# Altium schematic sheet Tiny817_Xplained_Pro_EDBG.SchDoc: Embedded Debugger (EDBG)
size A3; Organization: ATMEL Norway; Address1: Vestre Rosten 79; Address2: N-7075 TILLER; Address3: NORWAY; DocumentNumber: A09-2654; Revision: 4; SheetNumber: 9; SheetTotal: 9; PageSetup: Record=PageOptions|CenterHorizontal=True|CenterVertical=True|PrintScale=0.73|XCorrection=1.00|YCorrection=1.00|PrintKind=1|BorderSize=5000000|LeftOffset=0|BottomOffset=0|Orientation=2|PaperLength=1000|PaperWidth=1000|Scale=100|PaperSource=7|PrintQuality=-4|MediaType=1|DitherType=10|PaperKind=A3 (297 x 420 mm)|PrintScaleMode=1
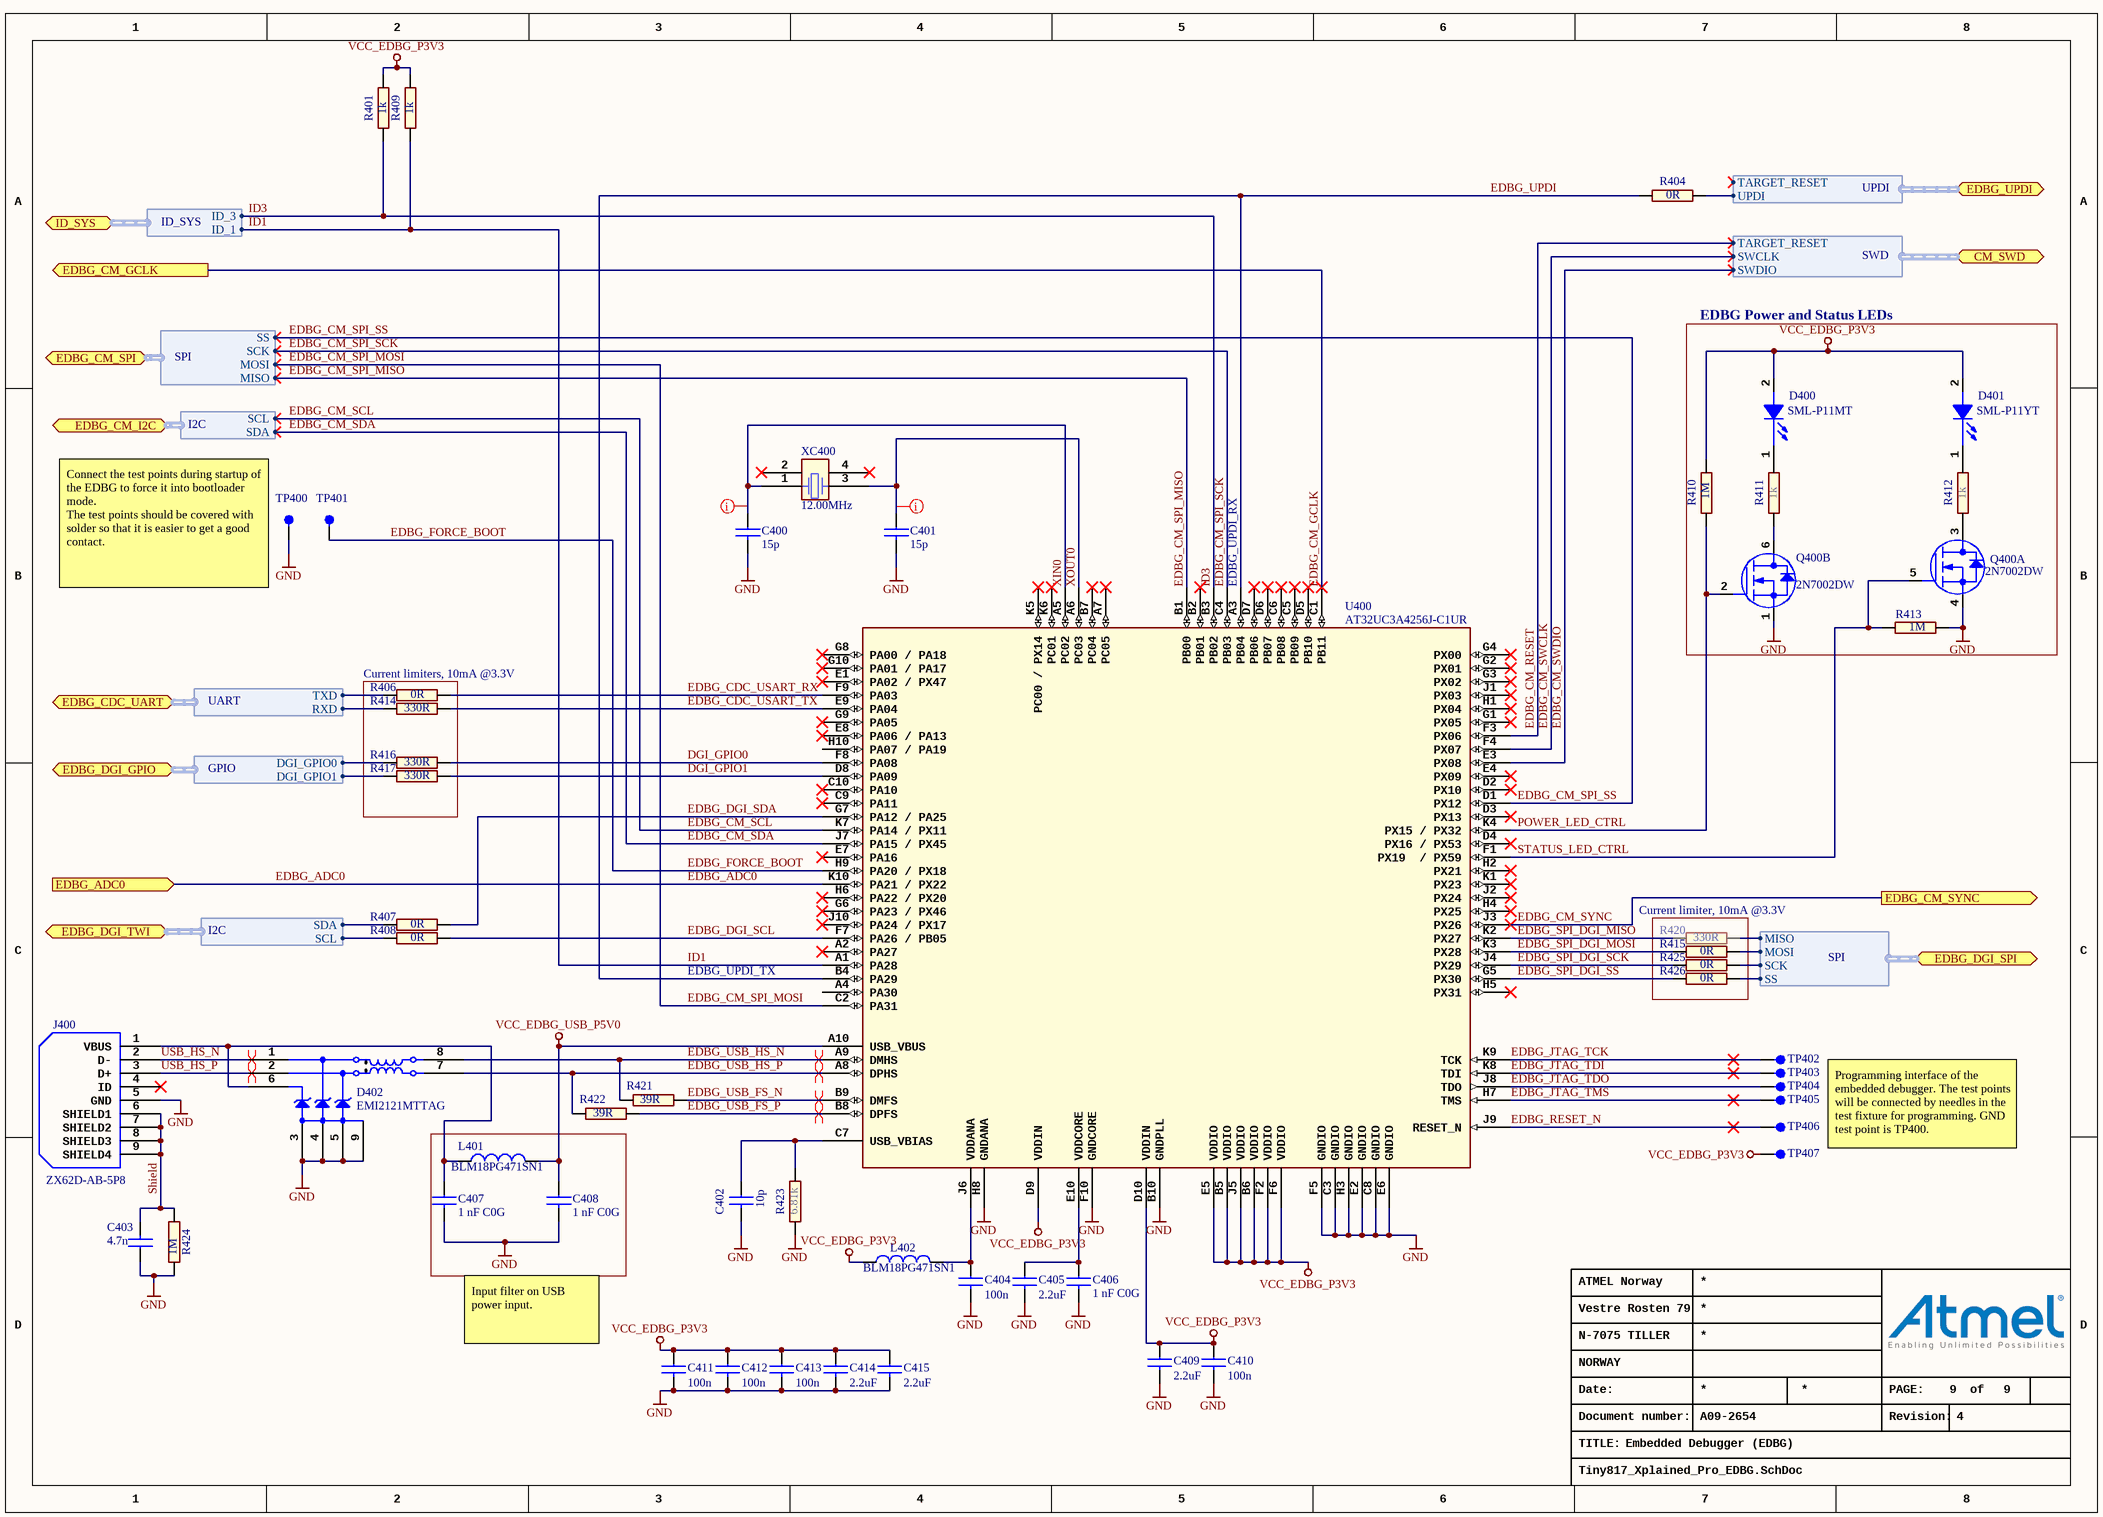
[diagram p0: Tiny817_Xplained_Pro_EDBG.SchDoc]

## Parts
C400  value 15p  [AP1-00053]
C401  value 15p  [AP1-00053]
C402  value 10p  [AP1-00053]
C403  value 4.7n  [AP1-00053]
C404  value 100n  [AP1-00053]
C405  value 2.2uF  [AP1-00053]  (hidden comment: Farnell no: 1288200)
C406  value 1 nF C0G  [AP1-00053]
C407  value 1 nF C0G  [AP1-00053]
C408  value 1 nF C0G  [AP1-00053]
C409  value 2.2uF  [AP1-00053]  (hidden comment: Farnell no: 1288200)
C410  value 100n  [AP1-00053]
C411  value 100n  [AP1-00053]
C412  value 100n  [AP1-00053]
C413  value 100n  [AP1-00053]
C414  value 2.2uF  [AP1-00053]  (hidden comment: Farnell no: 1288200)
C415  value 2.2uF  [AP1-00053]  (hidden comment: Farnell no: 1288200)
D400  value SML-P11MT  [AP4-00160]
D401  value SML-P11YT  [AP4-00160]
D402  value EMI2121MTTAG  [AP4-00159]
J400  value ZX62D-AB-5P8  [AP8-00852]  (hidden comment: 2,000 pieces per reel)
L401  value BLM18PG471SN1  [AP3-00005]
L402  value BLM18PG471SN1  [AP3-00005]
Q400  value 2N7002DW  [AP5-00001]  (hidden comment: Same as 2N7002 but with two MOSFETs in one package)  (parts A,B of 2)
R401  value 1k  [AP2-00000]
R404  value 0R  [AP2-00000]
R406  value 0R  [AP2-00000]
R407  value 0R  [AP2-00000]
R408  value 0R  [AP2-00000]
R409  value 1k  [AP2-00000]
R410  value 1M  [AP2-00011]
R411  value 1k  [AP2-00011]
R412  value 1k  [AP2-00011]
R413  value 1M  [AP2-00011]
R414  value 330R  [AP2-00000]
R415  value 0R  [AP2-00000]
R416  value 330R  [AP2-00000]
R417  value 330R  [AP2-00000]
R420  value 330R  [AP2-00000]
R421  value 39R  [AP2-00011]
R422  value 39R  [AP2-00011]
R423  value 6.81k  [AP2-00011]
R424  value 1M  [AP2-00011]
R425  value 0R  [AP2-00000]
R426  value 0R  [AP2-00000]
TP400  (no value)  [AP8-00010]  (no BOM)
TP401  (no value)  [AP8-00010]  (no BOM)
TP402  (no value)  [AP8-00010]  (no BOM)
TP403  (no value)  [AP8-00010]  (no BOM)
TP404  (no value)  [AP8-00010]  (no BOM)
TP405  (no value)  [AP8-00010]  (no BOM)
TP406  (no value)  [AP8-00010]  (no BOM)
TP407  (no value)  [AP8-00010]  (no BOM)
U400  value AT32UC3A4256J-C1UR  [AP6-00206]  (hidden comment: 100 ball VFBGA)
XC400  value 12.00MHz  [AP7-00089]

## Blocks framed on the sheet
EDBG Power and Status LEDs: D400 D401 Q400 R410-R413
Current limiters, 10mA @3.3V: R406 R414 R416 R417

## Ports
CM_SWD (harness SWD), EDBG_ADC0 (in), EDBG_CDC_UART (harness UART), EDBG_CM_GCLK (out), EDBG_CM_I2C (harness I2C), EDBG_CM_SPI (harness SPI), EDBG_CM_SYNC (out), EDBG_DGI_GPIO (harness GPIO), EDBG_DGI_SPI (harness SPI), EDBG_DGI_TWI (harness I2C), EDBG_UPDI (harness UPDI), ID_SYS (harness ID_SYS)

## Harnesses
UART: TXD, RXD
SPI: MISO, MOSI, SCK, SS
GPIO: DGI_GPIO0, DGI_GPIO1
ID_SYS: ID_1, ID_3
I2C: SCL, SDA
SWD: SWCLK, SWDIO, TARGET_RESET
UPDI: TARGET_RESET, UPDI

## Nets
GND: C400.2 C401.2 C402.2 C403.1 C404.2 C405.2 C406.2 C407.2 C408.2 C409.2 C410.2 C411.2 C412.2 C413.2 C414.2 C415.2 D402.3(GND) D402.4(GND) D402.5(GND) D402.9(GND) J400.5(GND) Q400.1(S2) Q400.4(S1) R413.1 R423.1 R424.1 TP400.1 U400.B10(GNDPLL) U400.C3(GNDIO) U400.C8(GNDIO) U400.E2(GNDIO) U400.E6(GNDIO) U400.F5(GNDIO) U400.F10(GNDCORE) U400.H3(GNDIO) U400.H8(GNDANA)
VCC_EDBG_P3V3: C409.1 C410.1 C411.1 C412.1 C413.1 C414.1 C415.1 D400.2(ANODE) D401.2(ANODE) L402.1 R401.2 R409.2 R410.2 TP407.1 U400.B5(VDDIO) U400.B6(VDDIO) U400.D9(VDDIN) U400.D10(VDDIN) U400.E5(VDDIO) U400.F2(VDDIO) U400.F6(VDDIO) U400.J5(VDDIO)
VCC_EDBG_USB_P5V0: C408.1 L401.2 U400.A10(USB_VBUS)
DGI_GPIO0: R416.2 U400.F8(PA08)
DGI_GPIO1: R417.2 U400.D8(PA09)
EDBG_ADC0: U400.K10(PA21_/_PX22) ; port EDBG_ADC0
EDBG_CDC_USART_RX: R406.1 U400.F9(PA03)
EDBG_CDC_USART_TX: R414.2 U400.E9(PA04)
EDBG_CM_GCLK: U400.C1(PB11) ; port EDBG_CM_GCLK
EDBG_CM_RESET: U400.F3(PX06) ; port CM_SWD.TARGET_RESET
EDBG_CM_SCL: U400.K7(PA14_/_PX11) ; port EDBG_CM_I2C.SCL
EDBG_CM_SDA: U400.J7(PA15_/_PX45) ; port EDBG_CM_I2C.SDA
EDBG_CM_SPI_MISO: U400.B1(PB00) ; port EDBG_CM_SPI.MISO
EDBG_CM_SPI_MOSI: U400.C2(PA31) ; port EDBG_CM_SPI.MOSI
EDBG_CM_SPI_SCK: U400.C4(PB03) ; port EDBG_CM_SPI.SCK
EDBG_CM_SPI_SS: U400.D1(PX12) ; port EDBG_CM_SPI.SS
EDBG_CM_SWCLK: U400.F4(PX07) ; port CM_SWD.SWCLK
EDBG_CM_SWDIO: U400.E3(PX08) ; port CM_SWD.SWDIO
EDBG_CM_SYNC: U400.J3(PX26) ; port EDBG_CM_SYNC
EDBG_DGI_SCL: R408.1 U400.F7(PA26_/_PB05)
EDBG_DGI_SDA: R407.1 U400.G7(PA12_/_PA25)
EDBG_FORCE_BOOT: TP401.1 U400.H9(PA20_/_PX18)
EDBG_JTAG_TCK: TP402.1 U400.K9(TCK)
EDBG_JTAG_TDI: TP403.1 U400.K8(TDI)
EDBG_JTAG_TDO: TP404.1 U400.J8(TDO)
EDBG_JTAG_TMS: TP405.1 U400.H7(TMS)
EDBG_RESET_N: TP406.1 U400.J9(RESET_N)
EDBG_SPI_DGI_MISO: R420.1 U400.K2(PX27)
EDBG_SPI_DGI_MOSI: R415.2 U400.K3(PX28)
EDBG_SPI_DGI_SCK: R425.2 U400.J4(PX29)
EDBG_SPI_DGI_SS: R426.2 U400.G5(PX30)
EDBG_UPDI: R404.2 U400.A3(PB04) U400.B4(PA29)
EDBG_USB_FS_N: R421.2 U400.B9(DMFS)
EDBG_USB_FS_P: R422.2 U400.B8(DPFS)
EDBG_USB_HS_N: D402.8(DIFF1_INT) R421.1 U400.A9(DMHS)
EDBG_USB_HS_P: D402.7(DIFF2_INT) R422.1 U400.A8(DPHS)
ID1: R409.1 U400.A1(PA28) ; port ID_SYS.ID_1
ID3: R401.1 U400.B3(PB02) ; port ID_SYS.ID_3
POWER_LED_CTRL: Q400.2(G2) R410.1 U400.K4(PX15_/_PX32)
Shield: C403.2 J400.6(SHIELD1) J400.7(SHIELD2) J400.8(SHIELD3) J400.9(SHIELD4) R424.2
STATUS_LED_CTRL: Q400.5(G1) R413.2 U400.F1(PX19__/_PX59)
USB_HS_N: D402.1(DIFF1_EXT) J400.2(D-)
USB_HS_P: D402.2(DIFF2_EXT) J400.3(D+)
XIN0: C400.1 U400.A5(PC02) XC400.1
XOUT0: C401.1 U400.A6(PC03) XC400.3
NetC402_1: C402.1 R423.2 U400.C7(USB_VBIAS)
NetC404_1: C404.1 L402.2 U400.J6(VDDANA)
NetC405_1: C405.1 C406.1 U400.E10(VDDCORE)
NetC407_1: C407.1 D402.6(VBUS) J400.1(VBUS) L401.1
NetD400_1: D400.1(CATHODE) R411.2
NetD401_1: D401.1(CATHODE) R412.2
NetQ400_3: Q400.3(D1) R412.1
NetQ400_6: Q400.6(D2) R411.1
NetR404_1: R404.1 ; port EDBG_UPDI.UPDI
NetR406_2: R406.2 ; port EDBG_CDC_UART.TXD
NetR407_2: R407.2 ; port EDBG_DGI_TWI.SDA
NetR408_2: R408.2 ; port EDBG_DGI_TWI.SCL
NetR414_1: R414.1 ; port EDBG_CDC_UART.RXD
NetR415_1: R415.1 ; port EDBG_DGI_SPI.MOSI
NetR416_1: R416.1 ; port EDBG_DGI_GPIO.DGI_GPIO0
NetR417_1: R417.1 ; port EDBG_DGI_GPIO.DGI_GPIO1
NetR420_2: R420.2 ; port EDBG_DGI_SPI.MISO
NetR425_1: R425.1 ; port EDBG_DGI_SPI.SCK
NetR426_1: R426.1 ; port EDBG_DGI_SPI.SS

Not connected (* = marked no-connect by the designer): J400 4(ID)*; U400 A2(PA27)* A4(PA30) A7(PC05)* B2(PB01)* B7(PC04)* C5(PB09)* C6(PB08)* C9(PA11)* C10(PA10)* D2(PX10)* D3(PX13)* D4(PX16_/_PX53)* D5(PB10)* D6(PB07)* D7(PB06)* E1(PA02_/_PX47)* E4(PX09)* E7(PA16)* E8(PA06_/_PA13)* G1(PX05)* G2(PX01)* G3(PX02)* G4(PX00)* G6(PA23_/_PX46)* G8(PA00_/_PA18)* G9(PA05)* G10(PA01_/_PA17)* H1(PX04)* H2(PX21)* H4(PX25)* H5(PX31)* H6(PA22_/_PX20)* H10(PA07_/_PA19) J1(PX03)* J2(PX24)* J10(PA24_/_PX17)* K1(PX23)* K5(PC00_/_PX14)* K6(PC01)*; XC400 2* 4*

## Layout directives
differential pair; rule Assembly Testpoint Usage [Testpoint - Not Allowed    Multiple - Not Allowed]: EDBG_USB_FS_N, EDBG_USB_FS_P, EDBG_USB_HS_N, EDBG_USB_HS_P, USB_HS_N, USB_HS_P
rule Assembly Testpoint Usage [Testpoint - Not Allowed    Multiple - Not Allowed]: XIN0, XOUT0

## Notes on the sheet
- (near TP400) Connect the test points during startup of the EDBG to force it into bootloader mode.
  The test points should be covered with solder so that it is easier to get a good contact.
- (near U400) EDBG_UPDI_RX
- Current limiter, 10mA @3.3V
- EDBG_UPDI_TX
- Programming interface of the embedded debugger. The test points will be connected by needles in the test fixture for programming. GND test point is TP400.
- Input filter on USB power input.
- Date:
- PAGE:
- of
- TITLE:
- Document number:
- Revision:

## Library data of the parts
C400 C401 = A01-0017: Ceramic capacitor, SMD 0402, NP0, 50V, +/-5%; PartGroup: Capacitors,Ceramic,SMD 0402; Manufacturer: AVX; MPN: 04025A150JAT2A; TemperatureRange: -55 - +125 deg C; AN: A01-0017; Height: 0,550000011920929; Tolerance: 50V, +/-5%
C402 = A01-0015: Ceramic capacitor, SMD 0402, NP0, 50V, +/-5%; PartGroup: Capacitors,Ceramic,SMD 0402; Manufacturer: AVX; MPN: 04025A100JAT2A; TemperatureRange: -55 - +125 deg C; AN: A01-0015; Tolerance: 50V, +/-5%; Height: 0,550000011920929
C403 = A01-0046: Ceramic capacitor, SMD 0402, X7R, 25V, +/-10%; PartGroup: Capacitors,Ceramic,SMD 0402; Manufacturer: PHYCOMP; MPN: 2238 587 15632; TemperatureRange: -55 - +125 deg C; AN: A01-0046; Tolerance: 25V, +/-10%; Height: 0,550000011920929
C404 C410-C413 = A01-0246: Ceramic capacitor, SMD 0402, X7R, 16V, +/-10%; PartGroup: Capacitors,Ceramic,SMD 0402; Manufacturer: Kemet; MPN: C0402C104K4RACTU; TemperatureRange: -55 - +125 deg C; AN: A01-0246; Tolerance: 16V, +/-10%; Height: 0,5
C405 C409 C414 C415 = A01-0300: Ceramic capacitor, SMD 0402, X5R, 6.3V, +/-20%; PartGroup: Capacitors,Ceramic,SMD 0402; Manufacturer: Kemet; MPN: C0402C225M9PAC; Tolerance: Â±20%; TemperatureRange: -55Â°C to +85Â°C; AN: A01-0300; Height: 0,5
C406-C408 = A01-0321: Ceramic capacitor, SMD 0402, C0G, 50V, +/-5%; PartGroup: Capacitors,Ceramic,SMD 0402; Manufacturer: Murata; MPN: GRM1555C1H102JA01D; Tolerance: 5%; AN: A01-0321; Height: 0,550000011920929
D400 = A10-0183: LED, SMD 0402, Green, Wave length=569nm, 2.1mcd @ (1mA, 1.9Vf); PartGroup: Opto,LEDs,SMD; Manufacturer: ROHM; MPN: SML-P11MT-T86; TemperatureRange: -40 to +85; AN: A10-0183; Height: 0,200000002980232
D401 = A10-0182: LED, SMD 0402, Yellow, Wave length=586nm, 7.6mcd @ (1mA, 1.9Vf); PartGroup: Opto,LEDs,SMD; Manufacturer: ROHM; MPN: SML-P11YT-T86; TemperatureRange: -40 to +85; AN: A10-0182; Height: 0,200000002980232
D402 = A04-0195: EMI2121, SZEMI2121 Single Pair Common Mode Filter with ESD Protection; PartGroup: Diodes,Transient suppression; Manufacturer: ON Semiconductor; TemperatureRange: âˆ’40 to +85 Â°C; AN: A04-0195; Height: 0,800000011920929; MPN: EMI2121MTTAG
J400 = A08-2112: Micro USB AB Connector, Standard SMT + DIP; PartGroup: Mechanical devices,Connectors,USB; Manufacturer: HIROSE; MPN: ZX62D-AB-5P8(30); AN: A08-2112; Height: 2,79999995231628
L401 L402 = A03-0035: SMD RF inductor 0603. Z=470Ohm (@100MHz), Max R(dc)=0.65Ohm, Max current=1A; PartGroup: Inductors,EMI; Manufacturer: Murata; TemperatureRange: -55; AN: A03-0035; Height: 0,800000011920929; MPN: BLM18PG471SN1
Q400 = A05-0051: Dual N-Channel MOSFET, 60V, 115mA cont,RDS(ON) < 7.5 Ohm @50mA@5V, SOT-363; PartGroup: Transistors,Small signal FET,SMD; Manufacturer: Fairchild; TemperatureRange: -65 to 150 deg C; AN: A05-0051; Height: 1,10000002384186; MPN: 2N7002DW
R401 R409 R411 R412 = A02-0212: Thick film resistor, SMD 0402, 1/16W, 1%; PartGroup: Resistors,SMD,0402 1%; Manufacturer: ASJ; MPN: CR10-1001-FK; TemperatureRange: -55 - +125 deg C; AN: A02-0212; Tolerance: 1 %; Height: 0,349999994039536
R404 R406-R408 R415 R425 R426 = A02-0163: RES 0.0 OHM 1/16W 0402 SMD; PartGroup: Resistors,SMD,0402 1%; Manufacturer: (n/a); MPN: RMCF0402ZT0R00; Tolerance: 1 %; TemperatureRange: -55 - +125 deg C; AN: A02-0163; Height: 0,349999994039536
R410 R413 R424 = A02-0284: Thick film resistor, SMD 0402, 1/16W, 1%; PartGroup: Resistors,SMD,0402 1%; Manufacturer: ASJ; MPN: CR10-1004-FK; TemperatureRange: -55 - +125 deg C; AN: A02-0284; Tolerance: 1 %; Height: 0,349999994039536
R414 R416 R417 R420 = A02-0200: Thick film resistor, SMD 0402, 1/16W, 1%; PartGroup: Resistors,SMD,0402 1%; Manufacturer: ASJ; MPN: CR10-3300-FK; TemperatureRange: -55 - +125 deg C; AN: A02-0200; Tolerance: 1 %; Height: 0,349999994039536
R421 R422 = A02-0178: Thick film resistor, SMD 0402, 1/16W, 1%; PartGroup: Resistors,SMD,0402 1%; Manufacturer: ASJ; MPN: CR10-39R0-FK; TemperatureRange: -55 - +125 deg C; AN: A02-0178; Tolerance: 1 %; Height: 0,349999994039536
R423 = A02-0539: Thick film resistor, SMD 0402, 1/16W, 1%; PartGroup: Resistors,SMD,0402 1%; Manufacturer: vishay; MPN: CRCW04026K81FKED; TemperatureRange: -55 - +125 deg C; AN: A02-0539; Tolerance: 1%; Height: 0,349999994039536
TP400-TP407 = A08-0004: Single SMD testpad; PartGroup: Mechanical devices,Connectors,Test points; AN: A08-0004; Value: TESTPAD; Height: 0
U400 = A06-0736: AVR 32-bit RISC MCU; PartGroup: Integrated Circuits,MCU, MPU, DSP,AVR MCU; Manufacturer: ATMEL; TemperatureRange: -40 to +85 deg C; AN: A06-0736; Height: 1; MPN: AT32UC3A4256J-C1UR
XC400 = A07-0128: Kyocera CX3225GB12000H0KPSC1, 12MHz, 12pF, SMD crystal; PartGroup: Frequency devices,Crystals,SMD; Manufacturer: Kyocera Crystal Device Corporation; Tolerance: Â±30ppm; TemperatureRange: -40Â°C to +85Â°C; AN: A07-0128; Height: 0,800000011920929; MPN: CX3225GB12000H0KPSC1